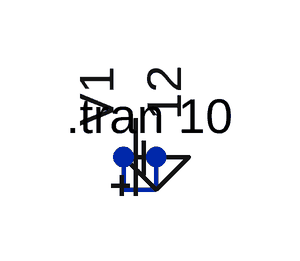
[diagram p0: schematic save.asc]
save.asc, the LTspice schematic file:
Version 4
SHEET 1 100 4
WIRE 0 0 0 8
WIRE 0 0 8 0
WIRE 16 0 16 8
WIRE 16 0 8 0
WIRE 0 16 0 8
WIRE 0 16 8 16
WIRE 16 16 8 16
WIRE 16 16 16 8
FLAG 16 0 0
SYMBOL _app\myvoltage 0 0 R270
SYMATTR InstName V1
SYMATTR Value 12
TEXT -28 -20 Left 2 !.tran 10

The netlist it stands for:
* save.asc
V1 0 0 12
.tran 10
.backanno
.end